# Altium project Documents.PrjPcb
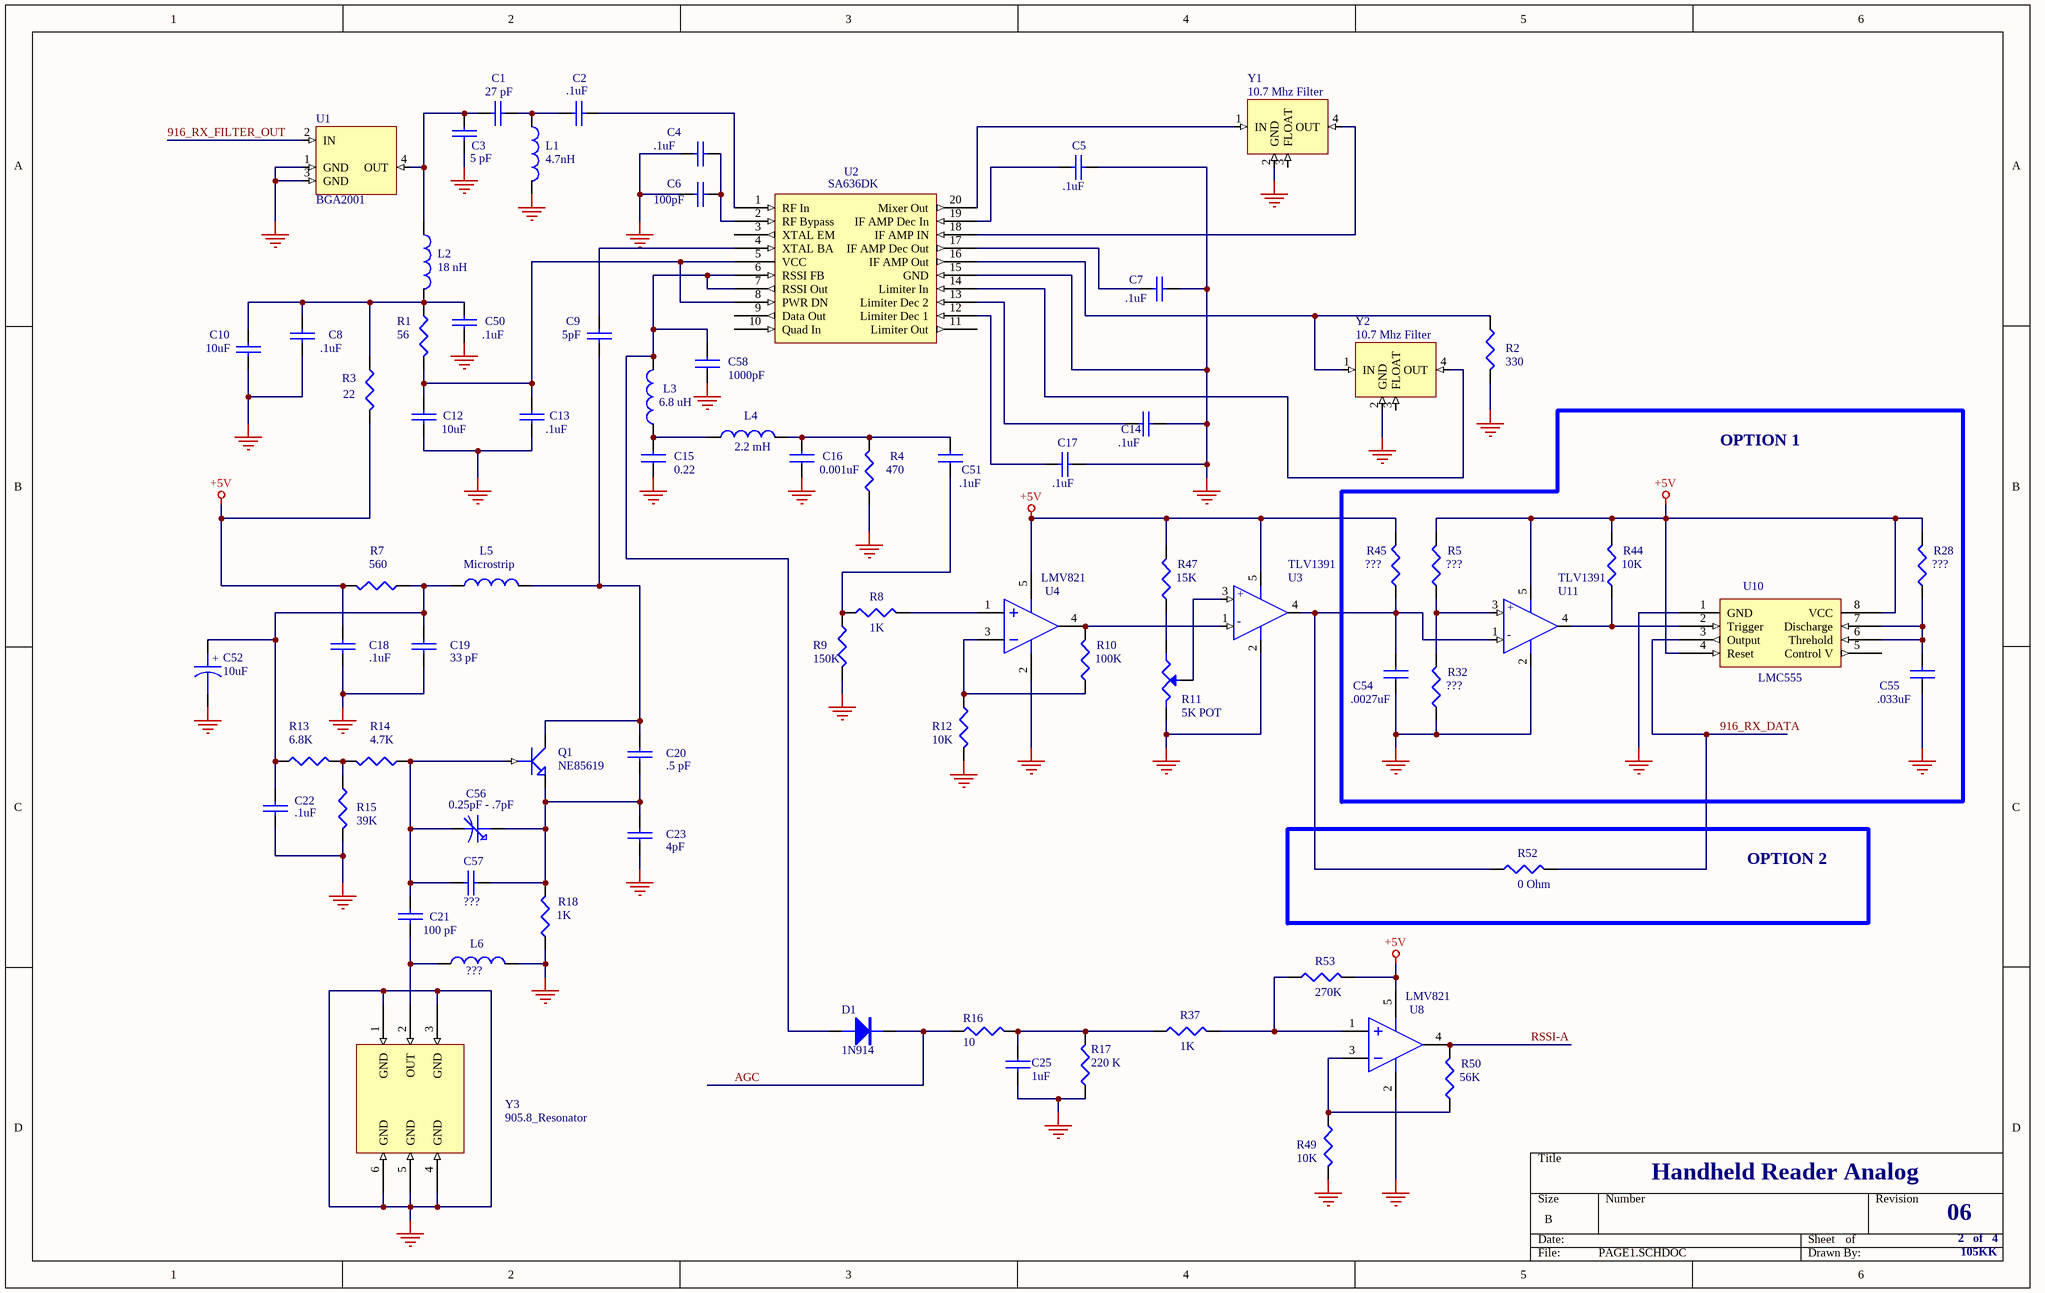
[diagram p0: PAGE1.SCHDOC]
4 sheets, 259 parts. Net scope: global (net labels, ports and power ports of the same name join across sheets).
Sheets:
  PAGE1.SCHDOC
  PAGE2.SCHDOC
  PAGE3.SCHDOC
  Sheet2.SCHDOC

## Sheet PAGE1.SCHDOC: 916 MHZ Super Hetrodyne Receiver
size B; DocumentNumber: Page Create Date; Revision: 3; SheetNumber: 1; SheetTotal: 3

### Parts
C1  27 pF  [0603]
C2  .1uF  [0603]
C3  5 pF  [0603]
C4  .1uF  [0603]
C5  .1uF  [0603]
C6  100pF  [0603]
C7  .1uF  [0603]
C8  .1uF  [0603]
C9  5pF  [0603]
C10  10uF  [CAP A CASE]
C12  10uF  [CAP A CASE]
C13  .1uF  [0603]
C14  .1uF  [0603]
C15  0.22  [0603]
C16  0.001uF  [0603]
C17  .1uF  [0603]
C18  .1uF  [0603]
C19  33 pF  [0603]
C20  .5 pF  [0603]
C21  100 pF  [0603]
C22  .1uF  [0603]
C23  4pF  [0603]
C25  1uF  [CAP A CASE]
C50  .1uF  [0603]
C51  .1uF  [0603]
C52  10uF  [CAP A CASE]
C54  .0027uF  [0603]
C55  .033uF  [0805]
C56  0.25pF - .7pF  [CAP TRIMMER JOHANSON]
C57  ???  [0603]
C58  1000pF  [0603]
D1  1N914  [SOT23 DIODE]
L1  4.7nH  [0603]
L2  18 nH  [0603]
L3  6.8 uH  [0805]
L4  2.2 mH  [COIL TKS5540CT-ND]
L5  Microstrip  [MICROSTRIP]
L6  ???  [0603]
Q1  NE85619  [3 PIN ULTRA SUPER MINI MOLD]
R1  56  [0603]
R2  330  [0603]
R3  22  [0603]
R4  470  [0603]
R5  ???  [0603]
R7  560  [0603]
R8  1K  [0603]
R9  150K  [0603]
R10  100K  [0603]
R11  5K POT  [POT PANA EVN5]
R12  10K  [0603]
R13  6.8K  [0603]
R14  4.7K  [0603]
R15  39K  [0603]
R16  10  [0603]
R17  220 K  [0603]
R18  1K  [0603]
R28  ???  [0603]
R32  ???  [0603]
R37  1K  [0603]
R44  10K  [0603]
R45  ???  [0603]
R47  15K  [0603]
R49  10K  [0603]
R50  56K  [0603]
R52  0 Ohm  [0603]
R53  270K  [0603]
U1  BGA2001  [SOT343]
U2  SA636DK  [SSOP20]
U3  TLV1391  [SOT25]
U4  LMV821  [SOT25]
U8  LMV821  [SOT25]
U10  LMC555  [SO8 SMALL]
U11  TLV1391  [SOT25]
Y1  10.7 Mhz Filter  [FILTER2]
Y2  10.7 Mhz Filter  [FILTER2]
Y3  905.8_Resonator  [RESONATOR2]

### Blocks framed on the sheet
OPTION 1: C54 C55 R5 R28 R32 R44 R45 U10 U11
OPTION 2: R52

### Nets
+5V: C18.1 R3.2 R5.2 R7.2 R28.2 R44.2 R45.2 R47.2 R53.2 U3.5(VDD) U4.5 U8.5 U10.4(Reset) U10.8(VCC) U11.5(VDD)
GND_SIGNAL: C3.2 C4.1 C5.2 C6.1 C7.2 C8.2 C10.2 C12.2 C13.2 C14.2 C15.1 C16.1 C17.2 C18.2 C19.2 C22.2 C23.2 C25.2 C50.2 C52.2 C54.1 C55.1 C58.1 L1.2 L6.2 R2.2 R4.1 R9.2 R11.3 R12.2 R15.2 R17.2 R18.1 R32.1 R49.2 U1.1(GND) U1.3(GND) U2.15(GND) U3.2(VSS) U4.2 U8.2 U10.1(GND) U11.2(VSS) Y1.2(GND) Y2.2(GND) Y3.1(GND) Y3.3(GND) Y3.4(GND) Y3.5(GND) Y3.6(GND)
916_RX_DATA: R52.2 U10.3(Output)
916_RX_FILTER_OUT: U1.2(IN)
AGC: D1.K R16.2
RSSI-A: R50.2 U8.4
NetC1_1: C1.1 C3.1 L2.1 U1.4(OUT)
NetC1_2: C1.2 C2.1 L1.1
NetC2_2: C2.2 U2.1(RF_In)
NetC4_2: C4.2 C6.2 U2.2(RF_Bypass)
NetC5_1: C5.1 U2.19(IF_AMP_Dec_In)
NetC7_1: C7.1 U2.17(IF_AMP_Dec_Out)
NetC8_1: C8.1 C10.1 C50.1 L2.2 R1.1 R3.1
NetC9_1: C9.1 C20.1 L5.2 Q1.C
NetC9_2: C9.2 U2.4(XTAL_BA)
NetC12_1: C12.1 C13.1 R1.2 U2.5(VCC) U2.8(PWR_DN)
NetC14_1: C14.1 U2.13(Limiter_Dec_2)
NetC15_2: C15.2 L3.1 L4.1
NetC16_2: C16.2 C51.2 L4.2 R4.2
NetC17_1: C17.1 U2.12(Limiter_Dec_1)
NetC19_1: C19.1 C22.1 C52.1 L5.1 R7.1 R13.1
NetC20_2: C20.2 C23.1 C56.1 C57.2 Q1.E R18.2
NetC21_1: C21.1 C56.2 C57.1 Q1.B R14.1
NetC21_2: C21.2 L6.1 Y3.2(OUT)
NetC25_1: C25.1 R16.1 R17.1 R37.1
NetC51_1: C51.1 R8.1 R9.1
NetC54_2: C54.2 R45.1 R52.1 U3.4(OUT) U11.1(-)
NetC55_2: C55.2 R28.1 U10.6(Threhold) U10.7(Discharge)
NetC58_2: C58.2 D1.A L3.2 U2.6(RSSI_FB) U2.7(RSSI_Out)
NetR2_1: R2.1 U2.16(IF_AMP_Out) Y2.1(IN)
NetR5_1: R5.1 R32.2 U11.3(+)
NetR8_2: R8.2 U4.1
NetR10_1: R10.1 R12.1 U4.3
NetR10_2: R10.2 U3.1(-) U4.4
NetR11_1: R11.1 R47.1
NetR11_2: R11.2 U3.3(+)
NetR13_2: R13.2 R14.2 R15.1
NetR37_2: R37.2 R53.1 U8.1
NetR44_1: R44.1 U10.2(Trigger) U11.4(OUT)
NetR49_1: R49.1 R50.1 U8.3
NetU2_14: U2.14(Limiter_In) Y2.4(OUT)
NetU2_18: U2.18(IF_AMP_IN) Y1.4(OUT)
NetU2_20: U2.20(Mixer_Out) Y1.1(IN)

Not connected (* = marked no-connect by the designer): U2 3(XTAL_EM) 9(Data_Out) 10(Quad_In) 11(Limiter_Out); U10 5(Control_V); Y1 3(FLOAT); Y2 3(FLOAT)

### Notes on the sheet
- Handheld Reader Analog
- 06
- 2   of   4
- 105KK
- (in symbol CAPACITOR POL) +

### Library data of the parts
C1-C10 C12-C14 C17-C23 C50 C57 = CAP: Capacitor
C15 C16 C25 C51 C54 C55 C58 = CAP_NP: Text Field1: 20; Text Field2: 10
C52 = CAPACITOR POL: Capacitor
C56 = CAPACITOR VAR: Text Field1: 20; Text Field2: 20
D1 = DIODE
L1-L6 = INDUCTOR: Text Field1: 20; Text Field2: 40
Q1 = NPN1: NPN Transistor
R1-R5 R8-R10 R12 R16 R17 R28 R32 R37 R44 R45 R47 R49 R50 R52 R53 = R: Text Field1: 20; Text Field2: 30
R7 R13-R15 R18 = RESISTOR: Text Field1: 20; Text Field2: 30
R11 = POT1: Potentiometer
U2 = SA636DK: Text Field1: 120; Text Field2: 110
U3 U11 = TLV1391: Text Field1: 40; Text Field2: 40
U4 U8 = OPAMP1
U10 = LMC555: Text Field1: 90; Text Field2: 50
Y1 Y2 = FILTER2
Y3 = RESONATOR2

## Sheet PAGE2.SCHDOC: 433 MHz Field Generator
size B; DocumentNumber: Page Create Date; Revision: 3; SheetNumber: 2; SheetTotal: 3
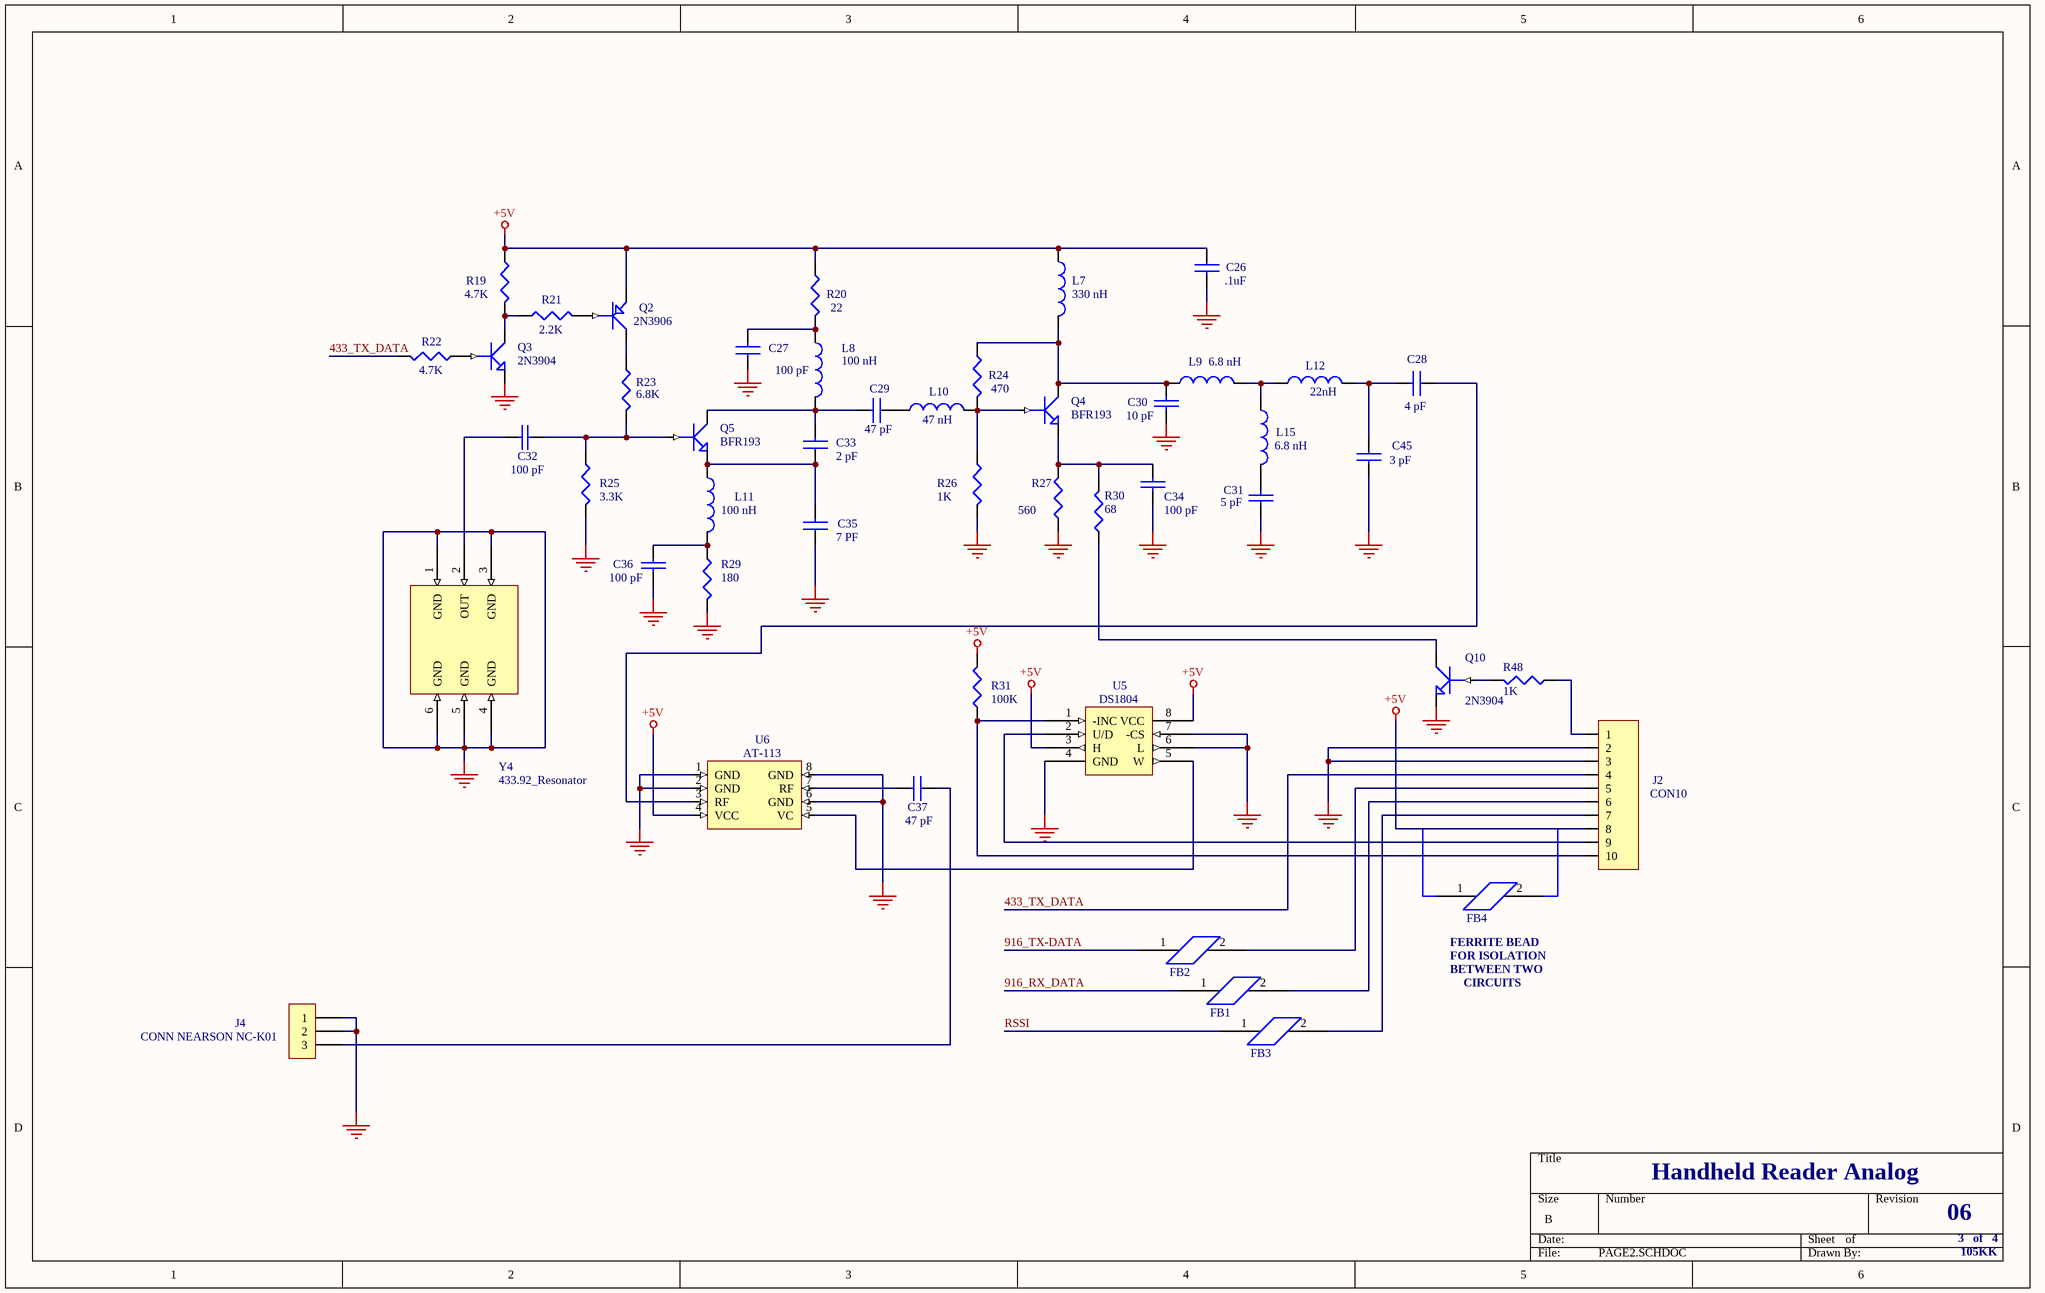
[diagram p1: PAGE2.SCHDOC]

### Parts
C26  .1uF  [0603]
C27  100 pF  [0603]
C28  4 pF  [0603]
C29  47 pF  [0603]
C30  10 pF  [0603]
C31  5 pF  [0603]
C32  100 pF  [0603]
C33  2 pF  [0603]
C34  100 pF  [0603]
C35  7 PF  [0603]
C36  100 pF  [0603]
C37  47 pF  [0603]
C45  3 pF  [0603]
FB1  FB  [0603]  (value not drawn)
FB2  FB  [0603]  (value not drawn)
FB3  FB  [0603]  (value not drawn)
FB4  FB  [0603]  (value not drawn)
J2  CON10  [1X10 HEADER]
J4  CONN NEARSON NC-K01  [CONN NEARSON NC-K01]
L7  330 nH  [0805]
L8  100 nH  [0603]
L9  6.8 nH  [0603]
L10  47 nH  [0603]
L11  100 nH  [0603]
L12  22nH  [0603]
L15  6.8 nH  [0603]
Q2  2N3906  [SOT23 TRANS]
Q3  2N3904  [SOT23 TRANS]
Q4  BFR193  [SOT23 TRANS]
Q5  BFR193  [SOT23 TRANS]
Q10  2N3904  [SOT23 TRANS]
R19  4.7K  [0603]
R20  22  [0603]
R21  2.2K  [0603]
R22  4.7K  [0603]
R23  6.8K  [0603]
R24  470  [0603]
R25  3.3K  [0603]
R26  1K  [0603]
R27  560  [0603]
R29  180  [0603]
R30  68  [0603]
R31  100K  [0603]
R48  1K  [0603]
U5  DS1804  [SO8 SMALL]
U6  AT-113  [SO8]
Y4  433.92_Resonator  [RESONATOR2]

### Nets
+5V: C26.1 J2.8 L7.1 Q2.E R19.1 R20.1 R31.1 U5.3(H) U5.8(VCC) U6.4(VCC)
GND_SIGNAL: C26.2 C27.1 C30.2 C31.2 C34.2 C35.1 C36.2 C45.2 J2.2 J2.3 J4.1 J4.2 Q3.E Q10.E R25.2 R26.2 R27.2 R29.2 U5.4(GND) U5.6(L) U5.7(-CS) U6.1(GND) U6.2(GND) U6.6(GND) U6.8(GND) Y4.1(GND) Y4.3(GND) Y4.4(GND) Y4.5(GND) Y4.6(GND)
433_TX_DATA: J2.4 R22.2
916_RX_DATA: FB1.1
916_TX-DATA: FB2.1
RSSI: FB3.1
NetC27_2: C27.2 L8.1 R20.2
NetC28_1: C28.1 U6.3(RF)
NetC28_2: C28.2 C45.1 L12.2
NetC29_1: C29.1 L10.1
NetC29_2: C29.2 C33.2 L8.2 Q5.C
NetC30_1: C30.1 L7.2 L9.1 Q4.C R24.1
NetC31_1: C31.1 L15.2
NetC32_1: C32.1 Y4.2(OUT)
NetC32_2: C32.2 Q5.B R23.2 R25.1
NetC33_1: C33.1 C35.2 L11.1 Q5.E
NetC34_1: C34.1 Q4.E R27.1 R30.2
NetC36_1: C36.1 L11.2 R29.1
NetC37_1: C37.1 J4.3
NetC37_2: C37.2 U6.7(RF)
NetFB1_2: FB1.2 J2.6
NetFB2_2: FB2.2 J2.5
NetFB3_2: FB3.2 J2.7
NetJ2_1: J2.1 R48.2
NetJ2_9: J2.9 U5.2(U/D)
NetJ2_10: J2.10 R31.2 U5.1(-INC)
NetL9_2: L9.2 L12.1 L15.1
NetL10_2: L10.2 Q4.B R24.2 R26.1
NetQ2_B: Q2.B R21.2
NetQ2_C: Q2.C R23.1
NetQ3_B: Q3.B R22.1
NetQ3_C: Q3.C R19.2 R21.1
NetQ10_B: Q10.B R48.1
NetQ10_C: Q10.C R30.1
NetU5_5: U5.5(W) U6.5(VC)

Not connected (* = marked no-connect by the designer): FB4 1(2) 2(1)

### Notes on the sheet
- (near FB4) FERRITE BEAD
- FOR ISOLATION
- BETWEEN TWO
- CIRCUITS
- Handheld Reader Analog
- 06
- 3   of   4
- 105KK

### Library data of the parts
C26-C29 C33 C35 C37 C45 = CAP_NP: Text Field1: 20; Text Field2: 10
C30-C32 C34 C36 = CAP: Capacitor
FB1-FB4 = FB_0603: Part Field 1: Part Number EXC-ML16A270U; Part Field 2: Vendor Panasonic - ECG; Part Field 3: Description BEAD CORE 27 OHM 4A 0603 SMD
J2 = CON10: Text Field1: 30; Text Field2: 110
J4 = CON3: Connector
L7-L12 L15 = INDUCTOR: Text Field1: 20; Text Field2: 40
Q2 = PNP1: PNP Transistor
Q3-Q5 Q10 = NPN1: NPN Transistor
R19-R27 R29-R31 R48 = RESISTOR: Text Field1: 20; Text Field2: 30
U5 = DS1804: Text Field1: 50; Text Field2: 50
U6 = AT-113A
Y4 = RESONATOR2

## Sheet PAGE3.SCHDOC: 916 MHz Transmitter
size B; DocumentNumber: Page Create Date; Revision: 3; SheetNumber: 3; SheetTotal: 3
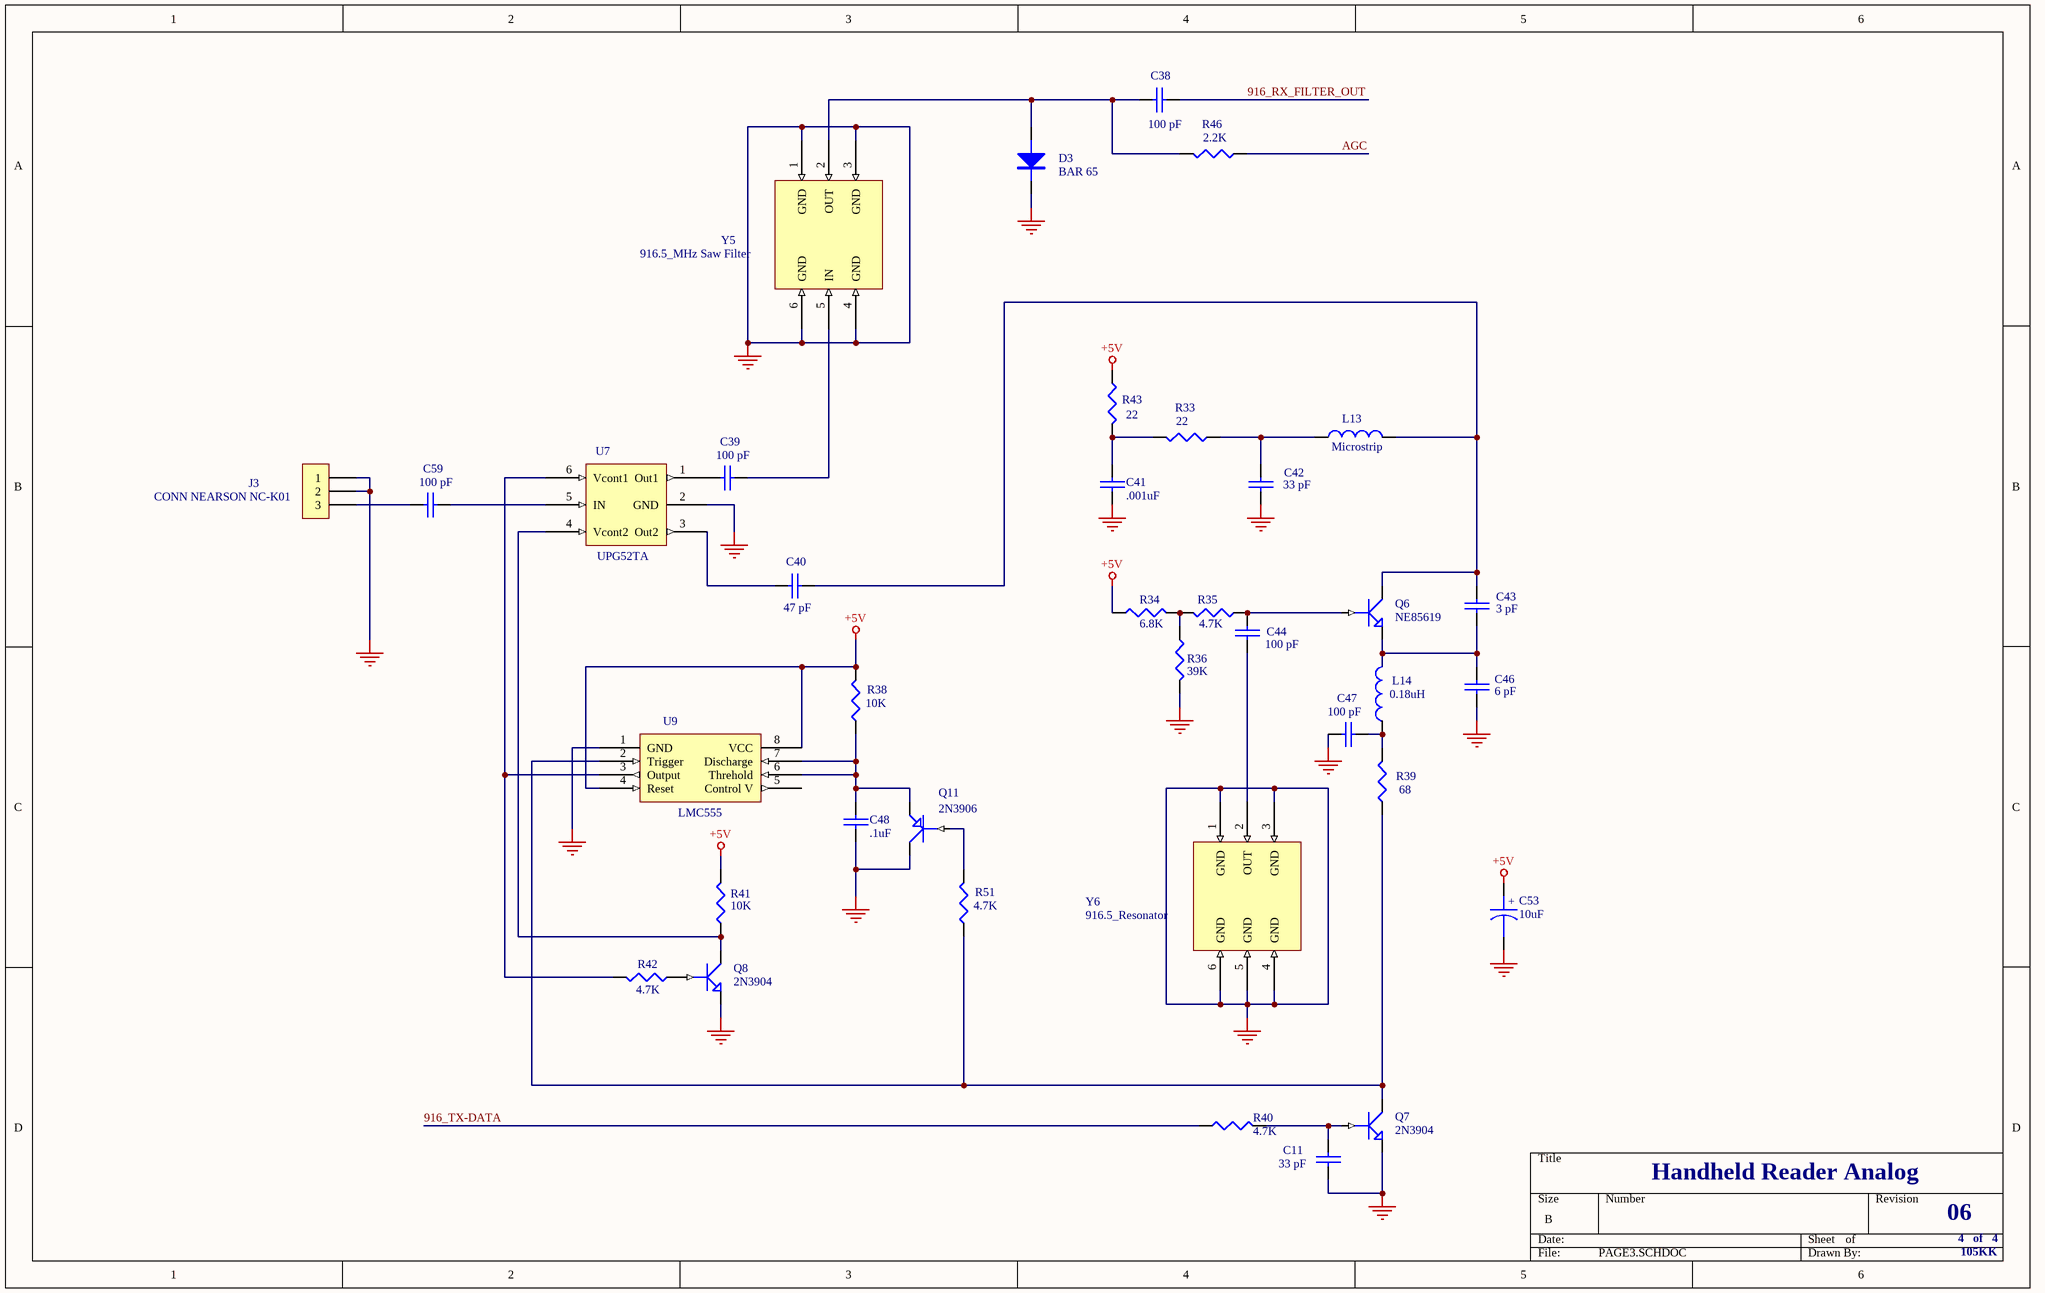
[diagram p2: PAGE3.SCHDOC]

### Parts
C11  33 pF  [0603]
C38  100 pF  [0603]
C39  100 pF  [0603]
C40  47 pF  [0603]
C41  .001uF  [0603]
C42  33 pF  [0603]
C43  3 pF  [0603]
C44  100 pF  [0603]
C46  6 pF  [0603]
C47  100 pF  [0603]
C48  .1uF  [0603]
C53  10uF  [CAP A CASE]
C59  100 pF  [0603]
D3  BAR 65  [DIODE SC79]
J3  CONN NEARSON NC-K01  [CONN NEARSON NC-K01]
L13  Microstrip  [MICROSTRIP]
L14  0.18uH  [0603]
Q6  NE85619  [3 PIN ULTRA SUPER MINI MOLD]
Q7  2N3904  [SOT23 TRANS]
Q8  2N3904  [SOT23 TRANS]
Q11  2N3906  [SOT23 TRANS]
R33  22  [0603]
R34  6.8K  [0603]
R35  4.7K  [0603]
R36  39K  [0603]
R38  10K  [0603]
R39  68  [0603]
R40  4.7K  [0603]
R41  10K  [0603]
R42  4.7K  [0603]
R43  22  [0603]
R46  2.2K  [0603]
R51  4.7K  [0603]
U7  UPG52TA  [TO6]
U9  LMC555  [SO8 SMALL]
Y5  916.5_MHz Saw Filter
Y6  916.5_Resonator  [RESONATOR2]

### Nets
+5V: C53.1 R34.1 R38.2 R41.2 R43.1 U9.4(Reset) U9.8(VCC)
GND_SIGNAL: C11.2 C41.2 C42.2 C46.2 C47.1 C48.2 C53.2 D3.K J3.1 J3.2 Q7.E Q8.E Q11.C R36.2 U7.2(GND) U9.1(GND) Y5.1(GND) Y5.3(GND) Y5.4(GND) Y5.6(GND) Y6.1(GND) Y6.3(GND) Y6.4(GND) Y6.5(GND) Y6.6(GND)
916_RX_FILTER_OUT: C38.2
916_TX-DATA: R40.1
AGC: R46.1
NetC11_1: C11.1 Q7.B R40.2
NetC38_1: C38.1 D3.A R46.2 Y5.2(OUT)
NetC39_1: C39.1 U7.1(Out1)
NetC39_2: C39.2 Y5.5(IN)
NetC40_1: C40.1 U7.3(Out2)
NetC40_2: C40.2 C43.1 L13.2 Q6.C
NetC41_1: C41.1 R33.2 R43.2
NetC42_1: C42.1 L13.1 R33.1
NetC43_2: C43.2 C46.1 L14.2 Q6.E
NetC44_1: C44.1 Q6.B R35.1
NetC44_2: C44.2 Y6.2(OUT)
NetC47_2: C47.2 L14.1 R39.2
NetC48_1: C48.1 Q11.E R38.1 U9.6(Threhold) U9.7(Discharge)
NetC59_1: C59.1 J3.3
NetC59_2: C59.2 U7.5(IN)
NetQ7_C: Q7.C R39.1 R51.1 U9.2(Trigger)
NetQ8_B: Q8.B R42.1
NetQ8_C: Q8.C R41.1 U7.4(Vcont2)
NetQ11_B: Q11.B R51.2
NetR34_2: R34.2 R35.2 R36.1
NetR42_2: R42.2 U7.6(Vcont1) U9.3(Output)

Not connected (* = marked no-connect by the designer): U9 5(Control_V)

### Notes on the sheet
- Handheld Reader Analog
- 06
- 4   of   4
- 105KK
- (in symbol CAPACITOR POL) +

### Library data of the parts
C11 C38-C44 C46-C48 C59 = CAP: Capacitor
C53 = CAPACITOR POL: Capacitor
D3 = DIODE
J3 = CON3: Connector
L13 L14 = INDUCTOR: Text Field1: 20; Text Field2: 40
Q6-Q8 = NPN1: NPN Transistor
Q11 = PNP1: PNP Transistor
R33-R36 R38-R43 R46 R51 = RESISTOR: Text Field1: 20; Text Field2: 30
U7 = UPG152TA_0: Text Field1: 60; Text Field2: 60
U9 = LMC555: Text Field1: 90; Text Field2: 50
Y5 = RESONATOR3
Y6 = RESONATOR2

## Sheet Sheet2.SCHDOC
size 431 x 279 mm; SheetNumber: 0; SheetTotal: 0
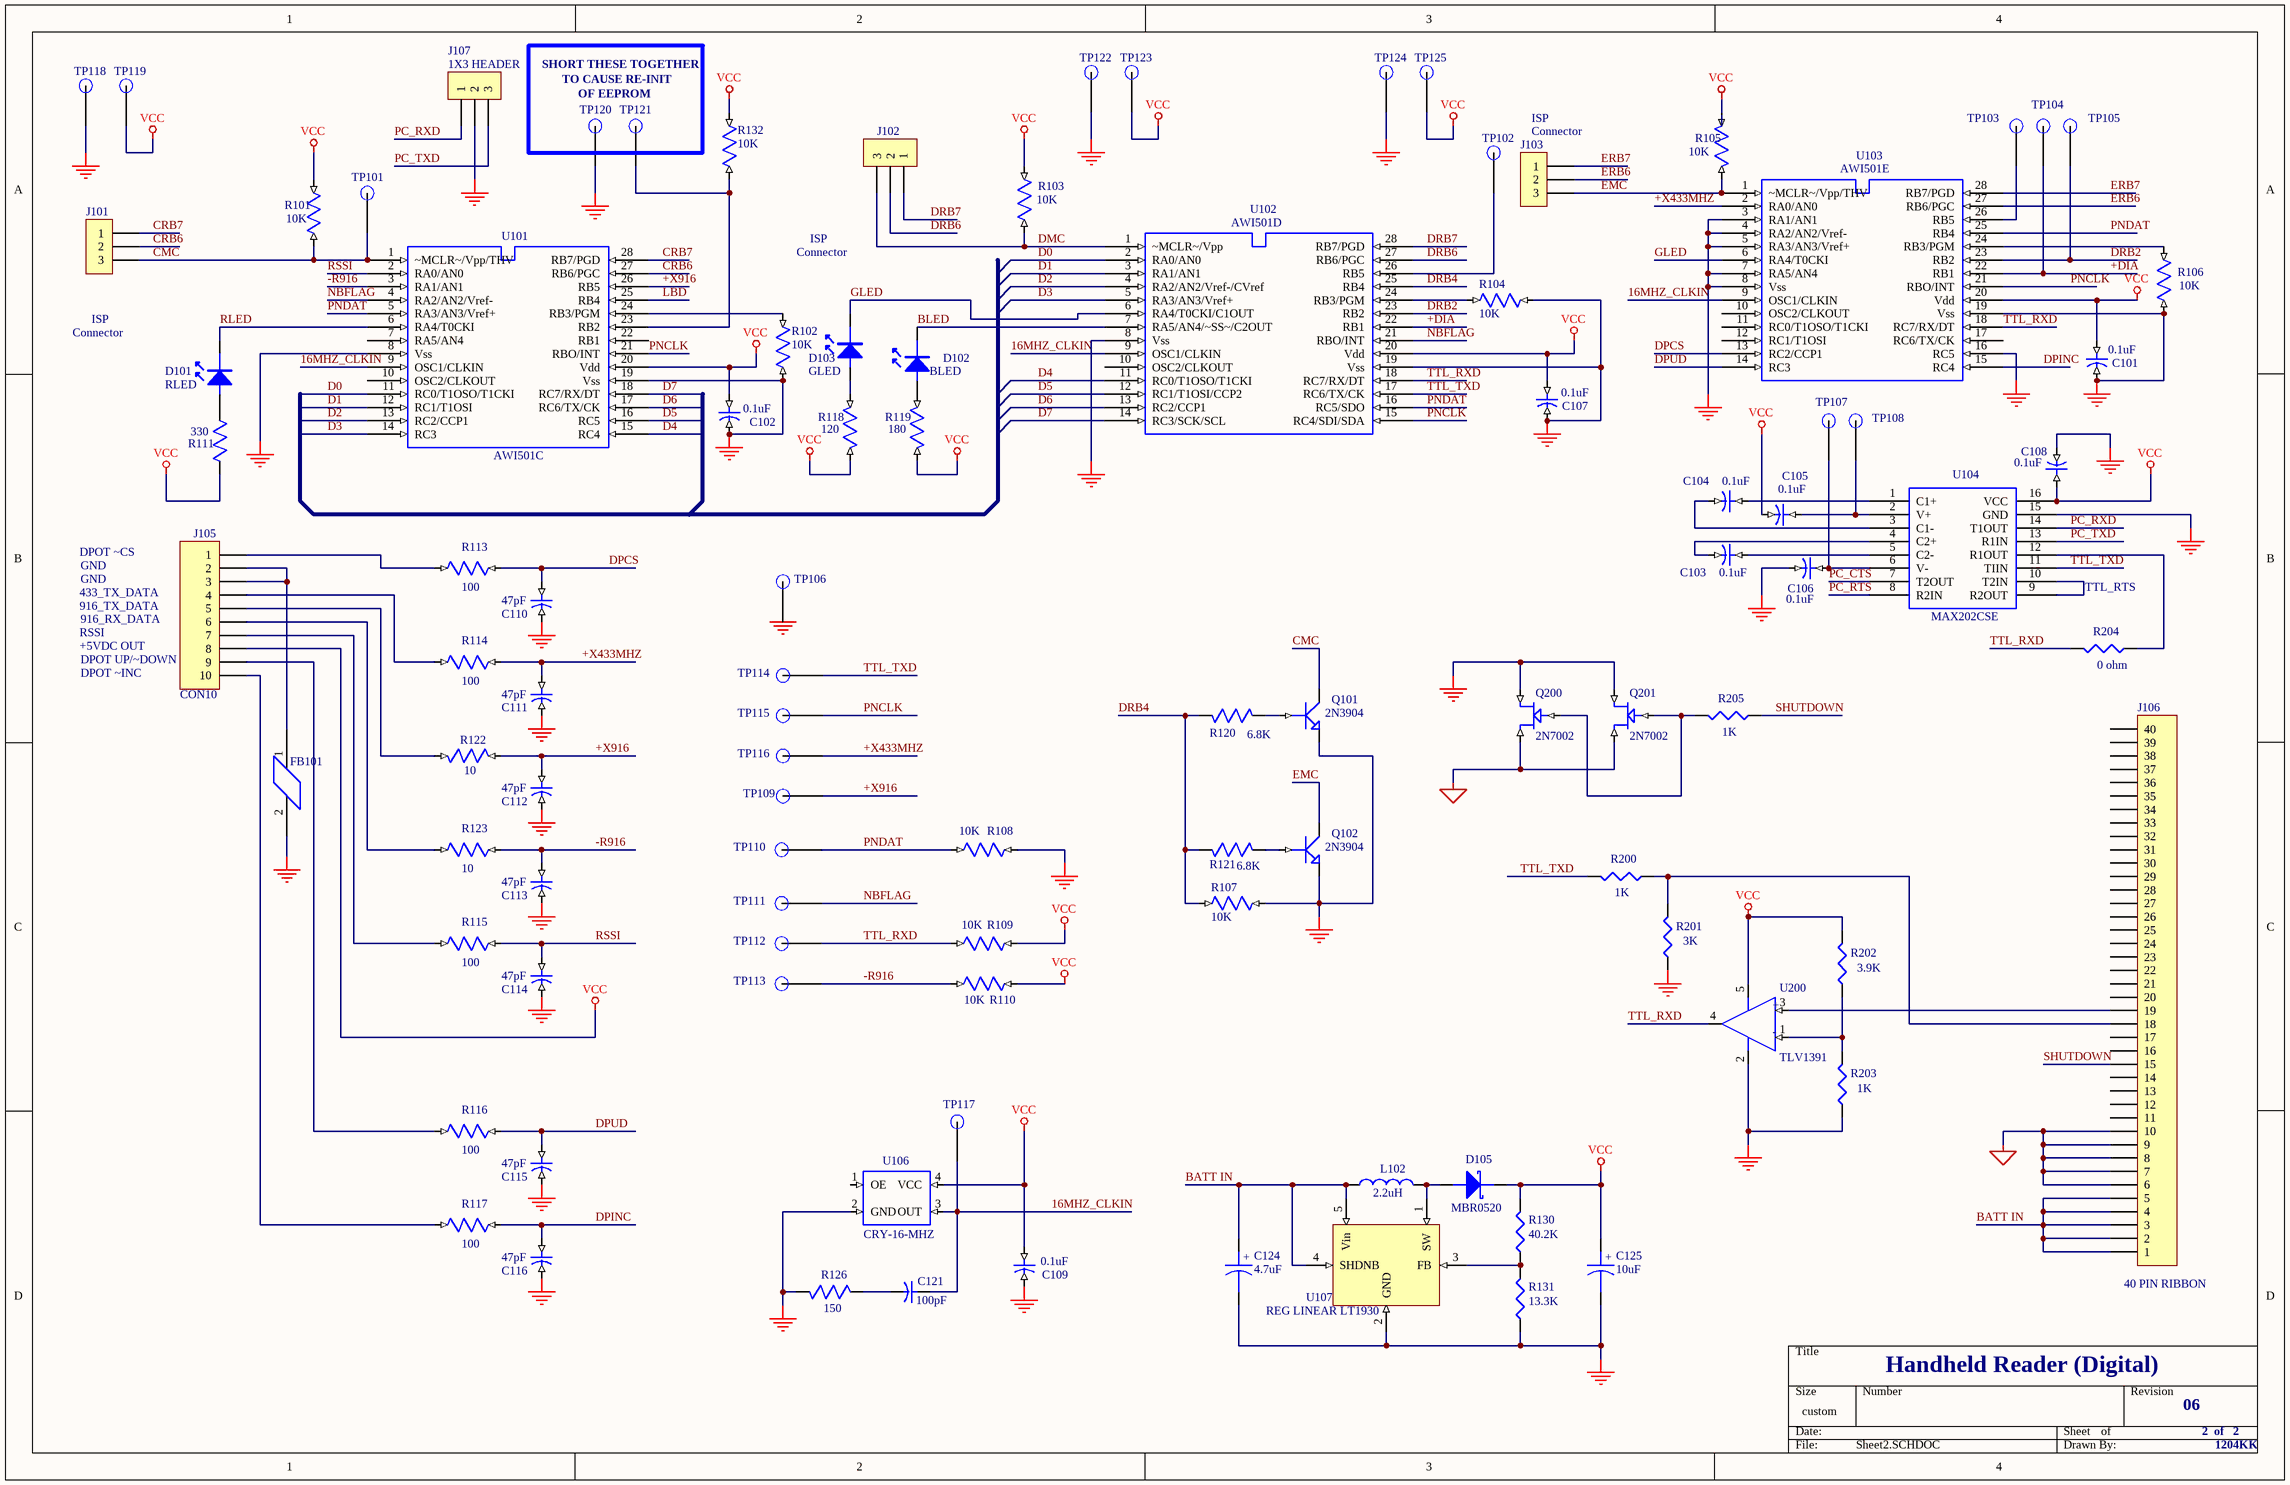
[diagram p3: Sheet2.SCHDOC]

### Parts
C101  0.1uF  [0603]
C102  0.1uF  [0603]
C103  0.1uF  [0603]
C104  0.1uF  [0603]
C105  0.1uF  [0603]
C106  0.1uF  [0603]
C107  0.1uF  [0603]
C108  0.1uF  [0603]
C109  0.1uF  [0603]
C110  47pF  [0603]
C111  47pF  [0603]
C112  47pF  [0603]
C113  47pF  [0603]
C114  47pF  [0603]
C115  47pF  [0603]
C116  47pF  [0603]
C121  100pF  [0603]
C124  4.7uF  [CAP A CASE]
C125  10uF  [CAP A CASE]
D101  RLED  [SOD123 DIODE]
D102  BLED  [SOD123 DIODE]
D103  GLED  [SOD123 DIODE]
D105  MBR0520  [SOD123]
FB101  FB 0603  [0603]  (value not drawn)
J101  1X3 HEADER  [1X3 HEADER]  (value not drawn)
J102  1X3 HEADER  [1X3 HEADER]  (value not drawn)
J103  1X3 HEADER  [1X3 HEADER]  (value not drawn)
J105  CON10  [1X10 HEADER SPECIAL]
J106  40 PIN RIBBON  [40 PIN RIBBON CONN]
J107  1X3 HEADER  [1X3 HEADER]
L102  2.2uH  [COIL BOURNS SDR7030-330M]
Q101  2N3904  [SOT23 TRANS]
Q102  2N3904  [SOT23 TRANS]
Q200  2N7002  [SOT23 FET]
Q201  2N7002  [SOT23 FET]
R101  10K  [0603]
R102  10K  [0603]
R103  10K  [0603]
R104  10K  [0603]
R105  10K  [0603]
R106  10K  [0603]
R107  10K  [0603]
R108  10K  [0603]
R109  10K  [0603]
R110  10K  [0603]
R111  330  [0603]
R113  100  [0603]
R114  100  [0603]
R115  100  [0603]
R116  100  [0603]
R117  100  [0603]
R118  120  [0603]
R119  180  [0603]
R120  6.8K  [0603]
R121  6.8K  [0603]
R122  10  [0603]
R123  10  [0603]
R126  150  [0603]
R130  40.2K  [0603]
R131  13.3K  [0603]
R132  10K  [0603]
R200  1K  [0603]
R201  3K  [0603]
R202  3.9K  [0603]
R203  1K  [0603]
R204  0 ohm  [0603]
R205  1K  [0603]
TP101  TP  [TEST POINT PAD]  (value not drawn)
TP102  TP  [TEST POINT PAD]  (value not drawn)
TP103  TP  [TEST POINT PAD]  (value not drawn)
TP104  TP  [TEST POINT PAD]  (value not drawn)
TP105  TP  [TEST POINT PAD]  (value not drawn)
TP106  TP  [TEST POINT PAD]  (value not drawn)
TP107  TP  [TEST POINT PAD]  (value not drawn)
TP108  TP  [TEST POINT PAD]  (value not drawn)
TP109  TP  [TEST POINT PAD]  (value not drawn)
TP110  TP  [TEST POINT PAD]  (value not drawn)
TP111  TP  [TEST POINT PAD]  (value not drawn)
TP112  TP  [TEST POINT PAD]  (value not drawn)
TP113  TP  [TEST POINT PAD]  (value not drawn)
TP114  TP  [TEST POINT PAD]  (value not drawn)
TP115  TP  [TEST POINT PAD]  (value not drawn)
TP116  TP  [TEST POINT PAD]  (value not drawn)
TP117  TP  [TEST POINT PAD]  (value not drawn)
TP118  TP  [TEST POINT PAD]  (value not drawn)
TP119  TP  [TEST POINT PAD]  (value not drawn)
TP120  TP  [TEST POINT PAD]  (value not drawn)
TP121  TP  [TEST POINT PAD]  (value not drawn)
TP122  TP  [TEST POINT PAD]  (value not drawn)
TP123  TP  [TEST POINT PAD]  (value not drawn)
TP124  TP  [TEST POINT PAD]  (value not drawn)
TP125  TP  [TEST POINT PAD]  (value not drawn)
U101  AWI501C  [SSOP28]
U102  AWI501D  [SSOP28]
U103  AWI501E  [SSOP28]
U104  MAX202CSE  [SO16]
U106  CRY-16-MHZ  [SMT OSCILLATOR]
U107  REG LINEAR LT1930  [SOT23-5A]
U200  TLV1391  [SOT25]

### Nets
GND1: J106.6 J106.7 J106.8 J106.9 J106.10 Q200.S Q201.S
GND_COM: C101.2(B) C102.2(B) C106.2(B) C107.2(B) C108.2(B) C109.2(B) C110.2(B) C111.2(B) C112.2(B) C113.2(B) C114.2(B) C115.2(B) C116.2(B) C124.2 C125.2 FB101.2 J107.2 Q101.E Q102.E Q200.D Q201.D R102.2(B) R104.1(A) R106.2(B) R107.2(B) R108.1(A) R126.2(B) R131.1 R201.1 R203.1 TP106.1(TP) TP118.1(TP) TP120.1(TP) TP122.1(TP) TP124.1(TP) U101.8(Vss) U101.19(Vss) U102.8(Vss) U102.19(Vss) U103.3(RA1/AN1) U103.4(RA2/AN2/Vref-) U103.5(RA3/AN3/Vref+) U103.7(RA5/AN4) U103.8(Vss) U103.16(RC5) U103.19(Vss) U104.15(GND) U106.2(GND) U107.2(GND) U200.2(VSS)
VCC: C101.1(A) C102.1(A) C105.2(B) C107.1(A) C108.1(A) C109.1(A) C125.1 D105.K J105.8 R101.1(A) R103.1(A) R105.1(A) R109.1(A) R110.1(A) R111.1(A) R118.1(A) R119.1(A) R130.2 R132.1(A) R202.2 TP119.1(TP) TP123.1(TP) TP125.1(TP) U101.20(Vdd) U102.20(Vdd) U103.20(Vdd) U104.16(VCC) U106.4(VCC) U200.5(VDD)
16MHZ_CLKIN: C121.1(A) TP117.1(TP) U101.9(OSC1/CLKIN) U102.9(OSC1/CLKIN) U103.9(OSC1/CLKIN) U106.3(OUT)
+DIA: TP104.1(TP) U102.22(RB1) U103.22(RB1)
+X433MHZ: C111.1(A) R114.2(B) TP116.1(TP) U103.2(RA0/AN0)
+X916: C112.1(A) R122.1(A) TP109.1(TP) U101.26(RB5)
-R916: C113.1(A) R110.2(B) R123.2(B) TP113.1(TP) U101.3(RA1/AN1)
BATT IN: C124.1 J106.1 J106.2 J106.3 J106.4 J106.5 L102.1 U107.4(SHDNB) U107.5(Vin)
BLED: D102.K U102.7(RA5/AN4/~SS~/C2OUT)
CMC: J101.3 Q101.C R101.2(B) TP101.1(TP) U101.1(~MCLR~/Vpp/THV)
CRB6: J101.2 U101.27(RB6/PGC)
CRB7: J101.1 U101.28(RB7/PGD)
D0: U101.11(RC0/T1OSO/T1CKI) U102.2(RA0/AN0)
D1: U101.12(RC1/T1OSI) U102.3(RA1/AN1)
D2: U101.13(RC2/CCP1) U102.4(RA2/AN2/Vref-/CVref)
D3: U101.14(RC3) U102.5(RA3/AN3/Vref+)
D4: U101.15(RC4) U102.11(RC0/T1OSO/T1CKI)
D5: U101.16(RC5) U102.12(RC1/T1OSI/CCP2)
D6: U101.17(RC6/TX/CK) U102.13(RC2/CCP1)
D7: U101.18(RC7/RX/DT) U102.14(RC3/SCK/SCL)
DMC: J102.3 R103.2(B) U102.1(~MCLR~/Vpp)
DPCS: C110.1(A) R113.2(B) U103.13(RC2/CCP1)
DPINC: C116.1(A) R117.2(B) U103.15(RC4)
DPUD: C115.1(A) R116.2(B) U103.14(RC3)
DRB2: TP105.1(TP) U102.23(RB2) U103.23(RB2)
DRB4: R107.1(A) R120.1(A) R121.1(A) U102.25(RB4)
DRB6: J102.2 U102.27(RB6/PGC)
DRB7: J102.1 U102.28(RB7/PGD)
EMC: J103.3 Q102.C R105.2(B) U103.1(~MCLR~/Vpp/THV)
ERB6: J103.2 U103.27(RB6/PGC)
ERB7: J103.1 U103.28(RB7/PGD)
GLED: D103.K U102.6(RA4/T0CKI/C1OUT) U103.6(RA4/T0CKI)
LBD: U101.25(RB4)
NBFLAG: TP111.1(TP) U101.4(RA2/AN2/Vref-) U102.21(RBO/INT)
PC_CTS: U104.7(T2OUT)
PC_RTS: U104.8(R2IN)
PC_RXD: J107.1 U104.14(T1OUT)
PC_TXD: J107.3 U104.13(R1IN)
PNCLK: TP115.1(TP) U101.21(RBO/INT) U102.15(RC4/SDI/SDA) U103.21(RBO/INT)
PNDAT: R108.2(B) TP110.1(TP) U101.5(RA3/AN3/Vref+) U102.16(RC5/SDO) U103.25(RB4)
RLED: D101.K U101.6(RA4/T0CKI)
RSSI: C114.1(A) R115.2(B) U101.2(RA0/AN0)
SHUTDOWN: J106.15 R205.1
TTL_RXD: R109.2(B) R204.2 TP112.1(TP) U102.18(RC7/RX/DT) U103.18(RC7/RX/DT) U200.4(OUT)
TTL_TXD: R200.2 TP114.1(TP) U102.17(RC6/TX/CK) U104.11(TIIN)
NetC103_1: C103.1(A) U104.5(C2-)
NetC103_2: C103.2(B) U104.4(C2+)
NetC104_1: C104.1(A) U104.1(C1+)
NetC104_2: C104.2(B) U104.3(C1-)
NetC105_1: C105.1(A) TP108.1(TP) U104.2(V+)
NetC106_1: C106.1(A) TP107.1(TP) U104.6(V-)
NetC121_2: C121.2(B) R126.1(A)
NetD101_A: D101.A R111.2(B)
NetD102_A: D102.A R119.2(B)
NetD103_A: D103.A R118.2(B)
NetD105_A: D105.A L102.2 U107.1(SW)
NetFB101_1: FB101.1 J105.2 J105.3
NetJ105_1: J105.1 R113.1(A)
NetJ105_4: J105.4 R114.1(A)
NetJ105_5: J105.5 R122.2(B)
NetJ105_6: J105.6 R123.1(A)
NetJ105_7: J105.7 R115.1(A)
NetJ105_9: J105.9 R116.1(A)
NetJ105_10: J105.10 R117.1(A)
NetJ106_18: J106.18 R200.1 R201.2
NetJ106_19: J106.19 U200.3(+)
NetQ101_B: Q101.B R120.2(B)
NetQ102_B: Q102.B R121.2(B)
NetQ200_G: Q200.G Q201.G R205.2
NetR102_1: R102.1(A) U101.24(RB3/PGM)
NetR104_2: R104.2(B) U102.24(RB3/PGM)
NetR106_1: R106.1(A) U103.24(RB3/PGM)
NetR130_1: R130.1 R131.2 U107.3(FB)
NetR132_2: R132.2(B) TP121.1(TP) U101.23(RB2)
NetR202_1: R202.1 R203.2 U200.1(-)
NetR204_1: R204.1 U104.12(R1OUT)
NetTP102_1: TP102.1(TP) U102.26(RB5)
NetTP103_1: TP103.1(TP) U103.26(RB5)
NetU104_9: U104.9(R2OUT) U104.10(T2IN)

Not connected (* = marked no-connect by the designer): J106 11 12 13 14 16 17 20 21 22 23 24 25 26 27 28 29 30 31 32 33 34 35 36 37 38 39 40; U101 7(RA5/AN4) 10(OSC2/CLKOUT) 22(RB1); U102 10(OSC2/CLKOUT); U103 10(OSC2/CLKOUT) 11(RC0/T1OSO/T1CKI) 12(RC1/T1OSI) 17(RC6/TX/CK); U106 1(OE)

### Notes on the sheet
- SHORT THESE TOGETHER
- TO CAUSE RE-INIT
- OF EEPROM
- ISP
- Connector
- DPOT ~CS
- GND
- 916_TX_DATA
- 433_TX_DATA
- RSSI
- 916_RX_DATA
- TTL_RTS
- +5VDC OUT
- DPOT ~INC
- DPOT UP/~DOWN
- Handheld Reader (Digital)
- 06
- 2  of   2
- 1204KK
- (in symbol CAPACITOR POL) +

### Library data of the parts
C101-C109 = C_603: Part Field 1: Part Number ECJ-1VF1H104Z; Part Field 2: Vendor Panasonic - ECG; Part Field 3: Description CAP .1UF 50V CERAMIC Y5V 0603
C110-C116 = C0603: Part Field 1: Part Number 0603N470J500NT; Part Field 2: Vendor BC Components; Part Field 3: Description Cap, Ceramic, 47pF, 50V, NP0, 0603, SMD
C121 = C_0603: Part Field 1: Part Number ECJ-1VC1H101J; Part Field 2: Vendor Panasonic - ECG; Part Field 3: Description CAP CERAMIC 100PF 50V 0603 SMD
C124 C125 = CAPACITOR POL: Capacitor
D101-D103 = LED
D105 = DIODE SCHOTTKY: Schottky Diode
FB101 = FB_0603: Part Field 1: Part Number EXC-ML16A270U; Part Field 2: Vendor Panasonic - ECG; Part Field 3: Description BEAD CORE 27 OHM 4A 0603 SMD
J101-J103 J107 = CON3: Connector
J105 = CON10: Connector
J106 = CON40: Connector
L102 = INDUCTOR1
Q101 Q102 = NPN1: NPN Transistor
Q200 Q201 = JFET N
R101-R110 R132 = R_603: Part Field 1: Part Number ERA-V15J103V; Part Field 2: Vendor Panasonic - ECG; Part Field 3: Description RES 10K OHM 1/16W 1500PPM 5%0603
R111 = R_0603: Part Field 1: Part Number ERJ-3GEYJ331V; Part Field 2: Vendor Panasonic - ECG; Part Field 3: Description RES 330 OHM 1/10W 5% 0603 SMD
R113-R117 R123 = R0603: Part Field 1: Part Number 9C06031A1000JLHFT; Part Field 2: Vendor Yageo America; Part Field 3: Description RES, 100 OHM, 1/10W, 5%, 0603, SMD
R118 = R0402: Part Field 1: Part Number ERJ-3GEYJ121V; Part Field 2: Vendor Panasonic - ECG; Part Field 3: Description RES 120 OHM 1/10W 5% 0603 SMD
R119 = R0402: Part Field 1: Part Number ERJ-3GEYJ181V; Part Field 2: Vendor Panasonic - ECG; Part Field 3: Description RES 180 OHM 1/10W 5% 0603 SMD
R120 R121 = R_0603: Part Field 1: Part Number ERJ-3GEYJ682V; Part Field 2: Vendor Panasonic - ECG; Part Field 3: Description RES 6.8K OHM 1/10W 5% 0603 SMD
R122 = R_603: Part Field 1: Part Number 9C06031A10R0FKHFT; Part Field 2: Vendor Yageo America; Part Field 3: Description RES, 10, OHM, 1/16W, 5%, 0603, SMD
R126 = R_0603: Part Field 1: Part Number 9C06031A1500JLHFT; Part Field 2: Vendor Yageo America; Part Field 3: Description RES 150 OHM 1/16W 5% 0603 SMD
R130 R131 R200-R205 = RES1
TP101-TP125 = TESTPOINT_1
U101 U103 = PIC16F870: Part Field 1: Part Number PIC16F870-E/SO; Part Field 2: Vendor Microchip Technology; Part Field 3: Description IC MCU CMOS 20MHZ 2K FLSH 28SOIC
U102 = PIC16F876A: Part Field 1: Part Number PIC16F876A-E/SO; Part Field 2: Vendor Microchip Technology; Part Field 3: Description IC MCU FLASH 8KX14 W/AD 28-SOIC
U104 = MAX202CSE: Part Field 1: Part Number MAX202CSE; Part Field 2: Vendor Maxim; Part Field 3: Description IC TRANSCEIVER RS232 5V 16-SOIC
U106 = CRY-SMD-5-7
U200 = TLV1391: Text Field1: 40; Text Field2: 40

## Nets that join several sheets
+5V: PAGE1 (15 pins), PAGE2 (10 pins), PAGE3 (7 pins)
GND_SIGNAL: PAGE1 (50 pins), PAGE2 (30 pins), PAGE3 (25 pins)
916_RX_DATA: PAGE1 (R52.2 U10.3), PAGE2 (FB1.1)
916_RX_FILTER_OUT: PAGE1 (U1.2), PAGE3 (C38.2)
916_TX-DATA: PAGE2 (FB2.1), PAGE3 (R40.1)
AGC: PAGE1 (D1.K R16.2), PAGE3 (R46.1)
RSSI: PAGE2 (FB3.1), Sheet2 (C114.1 R115.2 U101.2)